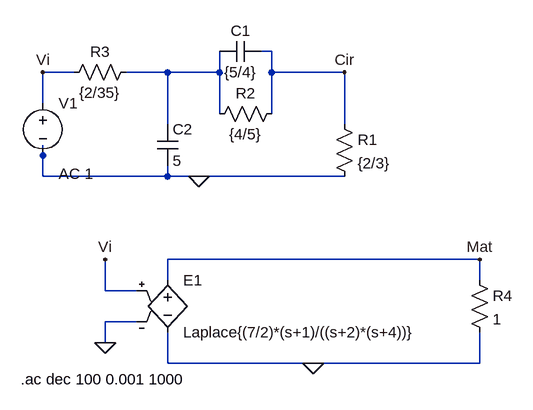
[diagram p0: schematic ej2.asc]
ej2.asc, the LTspice schematic file:
Version 4
SHEET 1 880 680
WIRE 224 80 208 80
WIRE -80 112 -128 112
WIRE 64 112 0 112
WIRE 144 112 144 80
WIRE 144 112 64 112
WIRE 224 112 224 80
WIRE 336 112 224 112
WIRE -128 160 -128 112
WIRE 144 176 144 112
WIRE 224 176 224 112
WIRE 64 192 64 112
WIRE 336 192 336 112
WIRE -128 240 -128 224
WIRE -128 272 -128 240
WIRE 64 272 64 256
WIRE 64 272 -128 272
WIRE 112 272 64 272
WIRE 336 272 112 272
WIRE 544 400 64 400
WIRE 64 432 64 400
WIRE 544 432 544 400
WIRE -32 448 -32 400
WIRE 16 448 -32 448
WIRE 16 496 -32 496
WIRE -32 528 -32 496
WIRE 64 560 64 512
WIRE 288 560 64 560
WIRE 544 560 544 512
WIRE 544 560 288 560
FLAG 112 272 0
FLAG 288 560 0
FLAG -128 112 Vi
FLAG -32 400 Vi
FLAG -32 528 0
FLAG 336 112 Cir
FLAG 544 400 Mat
SYMBOL res 320 176 R0
SYMATTR InstName R1
SYMATTR Value {2/3}
SYMBOL cap 208 64 R90
WINDOW 0 0 32 VBottom 2
WINDOW 3 32 32 VTop 2
SYMATTR InstName C1
SYMATTR Value {5/4}
SYMBOL res 240 160 R90
WINDOW 0 0 56 VBottom 2
WINDOW 3 32 56 VTop 2
SYMATTR InstName R2
SYMATTR Value {4/5}
SYMBOL cap 48 192 R0
SYMATTR InstName C2
SYMATTR Value 5
SYMBOL res 16 96 R90
WINDOW 0 0 56 VBottom 2
WINDOW 3 32 56 VTop 2
SYMATTR InstName R3
SYMATTR Value {2/35}
SYMBOL voltage -128 144 R0
WINDOW 123 24 124 Left 2
WINDOW 39 0 0 Left 0
SYMATTR InstName V1
SYMATTR Value ""
SYMATTR Value2 AC 1
SYMBOL res 528 416 R0
SYMATTR InstName R4
SYMATTR Value 1
SYMBOL e 64 416 R0
SYMATTR InstName E1
SYMATTR Value Laplace{(7/2)*(s+1)/((s+2)*(s+4))}
TEXT -162 584 Left 2 !.ac dec 100 0.001 1000

The netlist it stands for:
* ej2.asc
R1 Cir 0 {2/3}
C1 Cir N001 {5/4}
R2 Cir N001 {4/5}
C2 N001 0 5
R3 N001 Vi {2/35}
V1 Vi 0 AC 1
R4 Mat 0 1
E1 Mat 0 Vi 0 Laplace{(7/2)*(s+1)/((s+2)*(s+4))}
.ac dec 100 0.001 1000
.backanno
.end